# Altium project Buzzer_Module_v2.PrjPcb
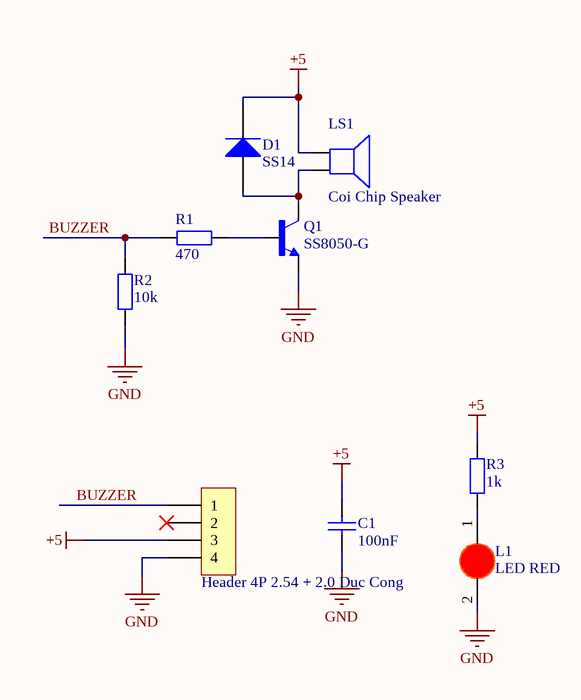
[diagram p0: Buzzer_v2_SCH.SchDoc]
1 sheet, 9 parts. Net scope: global (net labels, ports and power ports of the same name join across sheets).
Board file: Buzzer_v2_PCB.PcbDoc

## Sheet Buzzer_v2_SCH.SchDoc
size A4; SheetNumber: 1; SheetTotal: 1

### Parts
C1  100nF  [tu 0603]
D1  SS14  [DIODE SMA]
H1  Header 4P 2.54 + 2.0 Duc Cong  [Header 4P DC 2.54 + 2.0]
L1  LED RED  [LED-0805-Red]
LS1  Coi Chip Speaker  [Coi Chip Speacker]
Q1  SS8050-G  [TRANS_SS8050-G]
R1  470  [tro smd 0603]
R2  10k  [tro smd 0603]
R3  1k  [tro smd 0603]

### Nets
+5: C1.1 D1.2(K) H1.3 LS1.1 R3.2
GND: C1.2 H1.4 L1.2(K) Q1.2(E) R2.2
BUZZER: H1.1 R1.1 R2.1
NetD1_1: D1.1(A) LS1.2 Q1.3(C)
NetL1_1: L1.1(A) R3.1
NetQ1_1: Q1.1(B) R1.2

Not connected (* = marked no-connect by the designer): H1 2*

### Library data of the parts
C1 = Tu 0603 104 50V 10%: Dán; Don_Vi: Con; So_Chan: 2; Ten_Linh_Kien: Tụ 0603 104-100nF 10% 50V; Ma_Hang: MH004568; Chung_Loai: Dán; Kieu_Chan: *
D1 = Diode SS14 ( 1N5819): Dán; Ma_Hang: MH002211; Don_Vi: Con; Ten_Linh_Kien: Diode SS14 DO214 Schottky 1A 40V ( 1N5819 DO214); Chung_Loai: Dán; Ghi_Chu: *; Kieu_Chan: *
H1 = Header 4P 2.54 + 2.0 Duc Cong: Cắm; Ten_Linh_Kien: Header 4P XH2.54-4P Đực Cong; Don_Vi: Con; Ma_Hang: MH001310; Chung_Loai: Cắm
L1 = LED 0805 Do: Dán; Don_Vi: Con; Ma_Hang: MH000897; Ten_Linh_Kien: LED 0805 Màu Đỏ (Red); Ghi_Chu: *; Kieu_Chan: *; Chung_Loai: Dán
LS1 = Coi Chip Speaker: Còi chip
Q1 = SS8050-G: Bipolar (BJT) Transistor NPN 25 V 1.5 A 100MHz 300 mW Surface Mount SOT-23-3; MP: SS8050G; MF: Comchip; Digi-Key_Part_Number: 641-1790-2-ND; Check_prices: https://www.snapeda.com/parts/SS8050G/Comchip/view-part/?ref=eda; Package: None; SnapEDA_Link: https://www.snapeda.com/parts/SS8050G/Comchip/view-part/?ref=snap; Value: *
R1 R2 = Tro 0603 5% 100R: Dán; Don_Vi: Con; So_Chan: 2; Ten_Linh_Kien: Trở 0603 5% 100R; Ma_Hang: MH006315; Chung_Loai: Dán; Kieu_Chan: *
R3 = Tro 0603 1% 1k: Dán; So_Chan: 2; Don_Vi: Con; Ten_Linh_Kien: Trở 0603 1% 1k; Ma_Hang: MH006334; Chung_Loai: Dán; Kieu_Chan: *